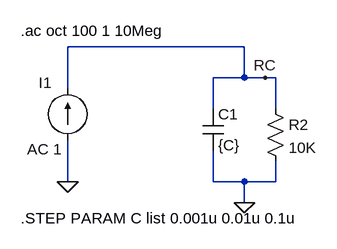
[diagram p0: schematic Fig_6-13_AC_RC-Pal_sweep_.asc]
Fig_6-13_AC_RC-Pal_sweep_.asc, the LTspice schematic file:
Version 4
SHEET 1 880 680
WIRE 448 32 176 32
WIRE 448 80 448 32
WIRE 448 80 400 80
WIRE 480 80 448 80
WIRE 496 80 480 80
WIRE 176 96 176 32
WIRE 400 128 400 80
WIRE 496 128 496 80
WIRE 176 240 176 176
WIRE 400 240 400 192
WIRE 448 240 400 240
WIRE 496 240 496 208
WIRE 496 240 448 240
WIRE 448 272 448 240
FLAG 176 240 0
FLAG 448 272 0
FLAG 480 80 RC
SYMBOL current 176 176 R180
WINDOW 0 24 88 Left 2
WINDOW 3 24 0 Left 0
WINDOW 123 9 -14 Left 2
WINDOW 39 0 0 Left 0
SYMATTR InstName I1
SYMATTR Value ""
SYMATTR Value2 AC 1
SYMBOL cap 384 128 R0
SYMATTR InstName C1
SYMATTR Value {C}
SYMBOL res 480 112 R0
SYMATTR InstName R2
SYMATTR Value 10K
TEXT 104 8 Left 2 !.ac oct 100 1 10Meg
TEXT 104 296 Left 2 !.STEP PARAM C list 0.001u 0.01u 0.1u

The netlist it stands for:
* Fig_6-13_AC_RC-Pal_sweep_.asc
I1 0 RC AC 1
C1 RC 0 {C}
R2 RC 0 10K
.ac oct 100 1 10Meg
.STEP PARAM C list 0.001u 0.01u 0.1u
.backanno
.end